# EAGLE design i2c-pressure-driver (EAGLE 9.6.2)
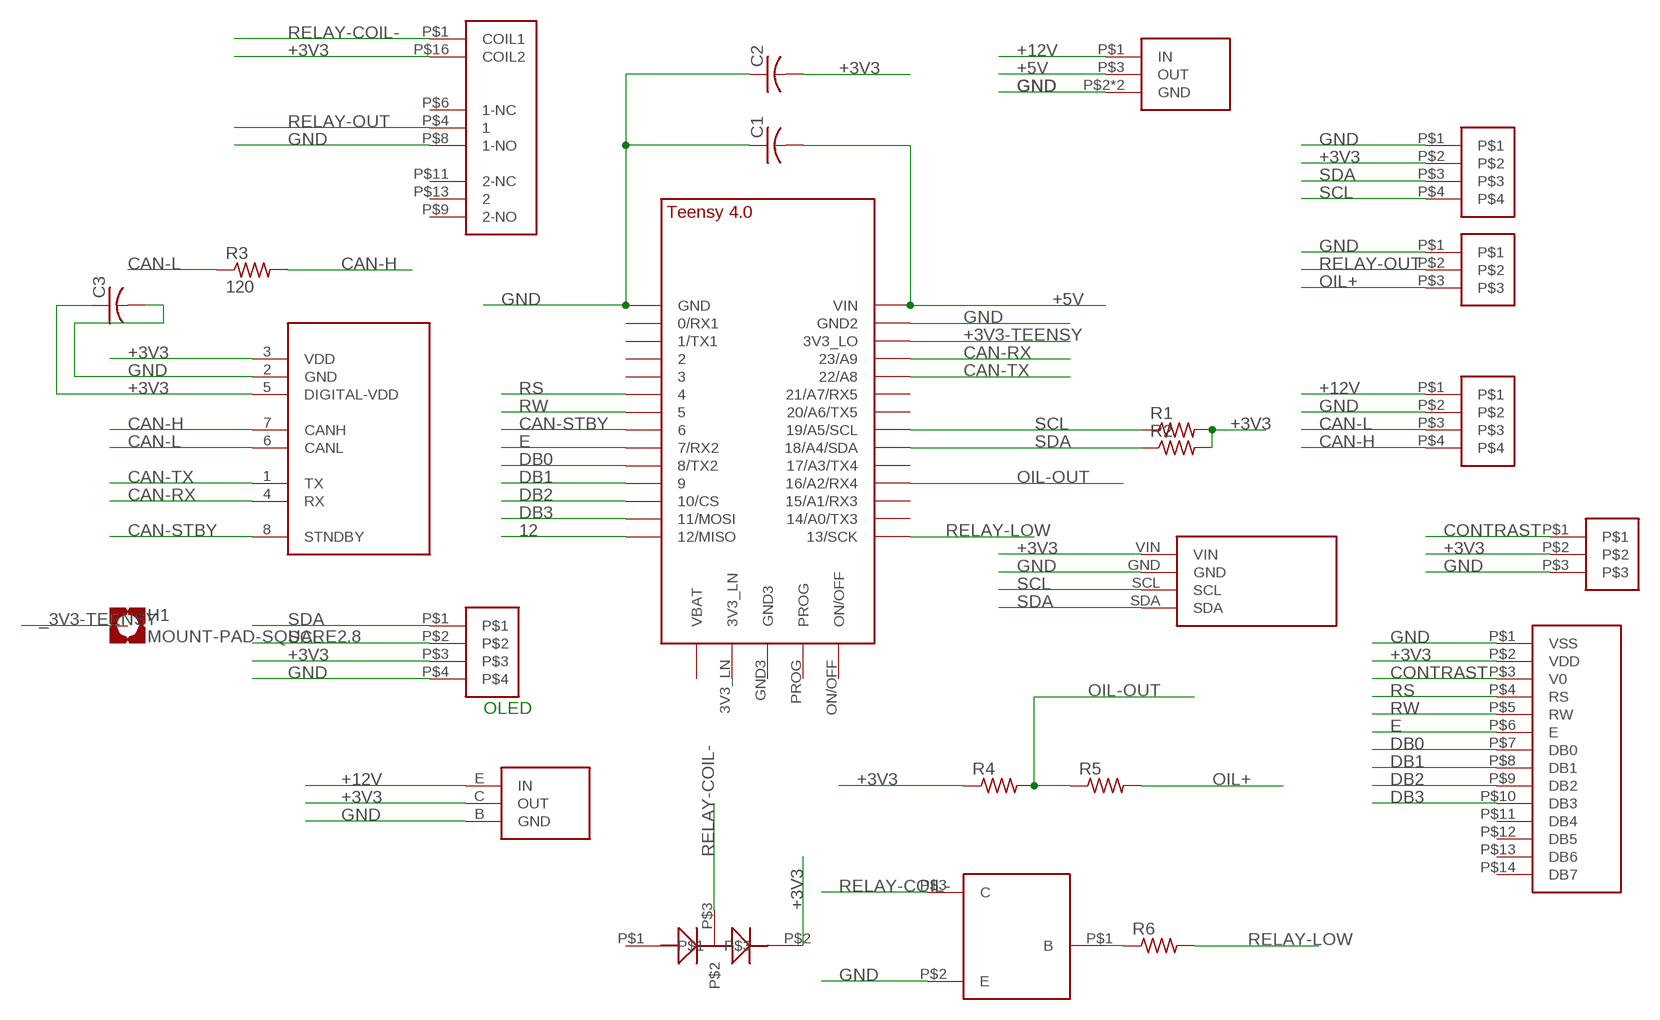
[diagram p0: schematic, sheet 1]

## Parts
C1  C-USC1210K  [C1210K]
C2  C-USC1210K  [C1210K]
C3  C-USC0603K  [C0603K]
H1  MOUNT-PAD-SQUARE2.8  [2,8-PAD-SQUARE]
R1  R-US_R0805  [R0805]
R2  R-US_R0805  [R0805]
R3  120  R-US_R0805W  [R0805W]
R4  R-US_M0805  [M0805]
R5  R-US_M0805  [M0805]
R6  R-US_R0805  [R0805]
U$1  TEENSY_4.0  [TEENSY_4.0]
U$2  NEWHAVEN-LCD-8X2  [NEWHAVEN-8X2-LCD]
U$3  LDO-3.3V-AZ1117CR-3.3TRG1  [SOT89-BCE]
U$4  1X4-1725672  [1X4-1725672]
U$5  1X3-1725669  [1X3-1725669]
U$6  1X4-1725672  [1X4-1725672]
U$7  MCP2562FD-CAN-TRANCIEVER  [SOIC8]
U$8  TC33X-2-102E-POT  [TC33-X-2]
U$9  1X4-1725672  [1X4-1725672]
U$10  LDO-5V-AZ1117CH2-5.0TRG1  [SOT-223]
U$11  BMP180-BREKOUT  [BMP180-BOARD]
U$12  RELAY-AMAZON  [RELAY-3V-AMAZON]
U$13  NPN-GENERAL  [SOT23]
U$14  DIODE-MMBD4148SE  [SOT23]

## Nets
12: U$1.12/MISO
+3V3: C2.2 C3.1 R1.2 R2.2 R4.1 U$2.P$2(VDD) U$3.C(OUT) U$4.P$2 U$7.3(VDD) U$7.5(DIGITAL-VDD) U$8.P$2 U$9.P$3 U$11.VIN U$12.P$16(COIL2) U$14.P$2
+3V3-TEENSY: U$1.3V3_LO
+5V: C1.2 U$1.VIN U$10.P$3(OUT)
+12V: U$3.E(IN) U$6.P$1 U$10.P$1(IN)
_3V3-TEENSY: H1.B2,8(MOUNT)
CAN-H: R3.2 U$6.P$4 U$7.7(CANH)
CAN-L: R3.1 U$6.P$3 U$7.6(CANL)
CAN-RX: U$1.23/A9 U$7.4(RX)
CAN-STBY: U$1.6 U$7.8(STNDBY)
CAN-TX: U$1.22/A8 U$7.1(TX)
CONTRAST: U$2.P$3(V0) U$8.P$1
DB0: U$1.8(8/TX2) U$2.P$7(DB0)
DB1: U$1.9/CS U$2.P$8(DB1)
DB2: U$1.10/CS U$2.P$9(DB2)
DB3: U$1.11/MOSI U$2.P$10(DB3)
E: U$1.7(7/RX2) U$2.P$6(E)
GND: C1.1 C2.1 C3.2 U$1.GND U$1.GND2 U$2.P$1(VSS) U$3.B(GND) U$4.P$1 U$5.P$1 U$6.P$2 U$7.2(GND) U$8.P$3 U$9.P$4 U$10.P$2(GND) U$10.PAD(GND) U$11.GND U$12.P$8(1-NO) U$13.P$2(E)
N$3: R6.1 U$13.P$1(B)
OIL+: R5.2 U$5.P$3
OIL-OUT: R4.2 R5.1 U$1.16/A2(16/A2/RX4)
RELAY-COIL-: U$12.P$1(COIL1) U$13.P$3(C) U$14.P$3
RELAY-LOW: R6.2 U$1.13/SCK
RELAY-OUT: U$5.P$2 U$12.P$4
RS: U$1.4/CANRX U$2.P$4(RS)
RW: U$1.5 U$2.P$5(RW)
SCL: R1.1 U$1.19/A5/SCL U$4.P$4 U$9.P$2 U$11.SCL
SDA: R2.1 U$1.18/A4/SDA U$4.P$3 U$9.P$1 U$11.SDA
Unconnected: U$1.0/RX(0/RX1) U$1.1/TX(1/TX1) U$1.2 U$1.3/CANTX U$1.3V3_LN U$1.14/A0(14/A0/TX3) U$1.15/A1(15/A1/RX3) U$1.17/A3(17/A3/TX4) U$1.20/A6(20/A6/TX5) U$1.21/A7(21/A7/RX5) U$1.GND3 U$1.ON/OFF U$1.PROG U$1.VBAT\(VBAT) U$2.P$11(DB4) U$2.P$12(DB5) U$2.P$13(DB6) U$2.P$14(DB7) U$12.P$6(1-NC) U$12.P$9(2-NO) U$12.P$11(2-NC) U$12.P$13 U$14.P$1

## Notes on the sheet
- OLED

## Library data of the parts
C1-C3 = rcl:C-US: CAPACITOR, American symbol; SPICEPREFIX: C
H1 = holes:MOUNT-PAD-SQUARE: MOUNTING PAD, square
R1-R6 = rcl:R-US_: RESISTOR, American symbol; SPICEPREFIX: R
U$1 = TEENSY 4.0:TEENSY_4.0
U$2 = mgregg:NEWHAVEN-LCD-8X2
U$3 = mgregg:LDO-3.3V-AZ1117CR-3.3TRG1
U$4 U$6 U$9 = mgregg:1X4-1725672
U$5 = mgregg:1X3-1725669
U$7 = mgregg:MCP2562FD-CAN-TRANCIEVER
U$8 = mgregg:TC33X-2-102E-POT
U$10 = mgregg:LDO-5V-AZ1117CH2-5.0TRG1
U$11 = mgregg:BMP180-BREKOUT
U$12 = mgregg:RELAY-AMAZON
U$13 = mgregg:NPN-GENERAL
U$14 = mgregg:DIODE-MMBD4148SE

## Board
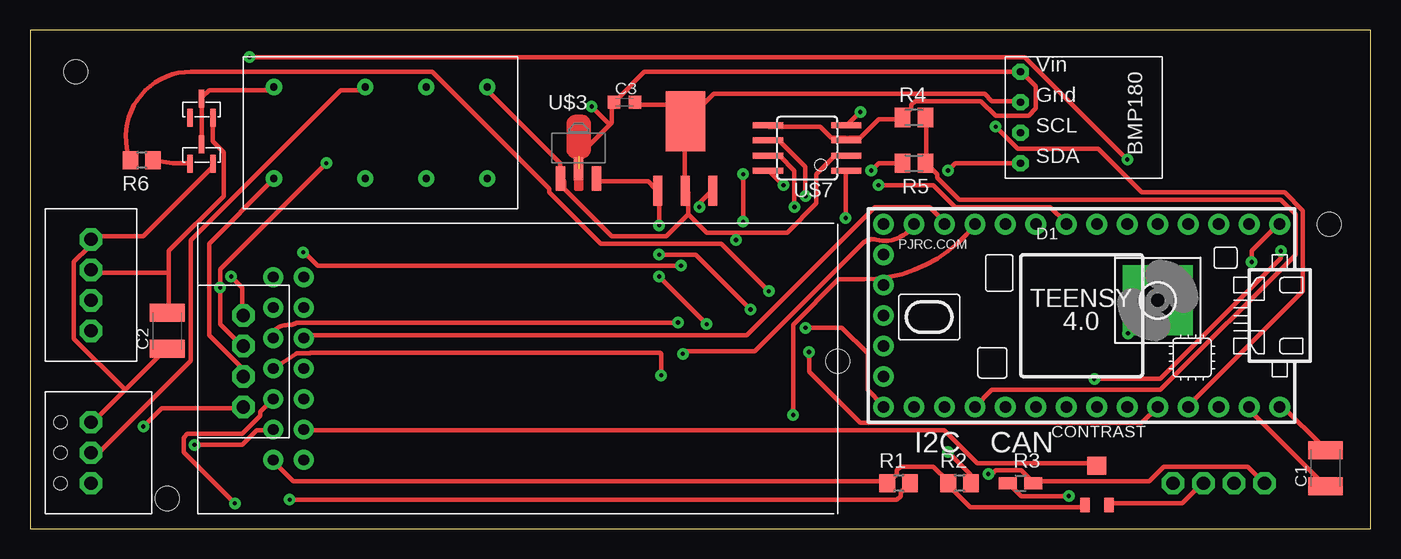
[diagram p1: board, top side]
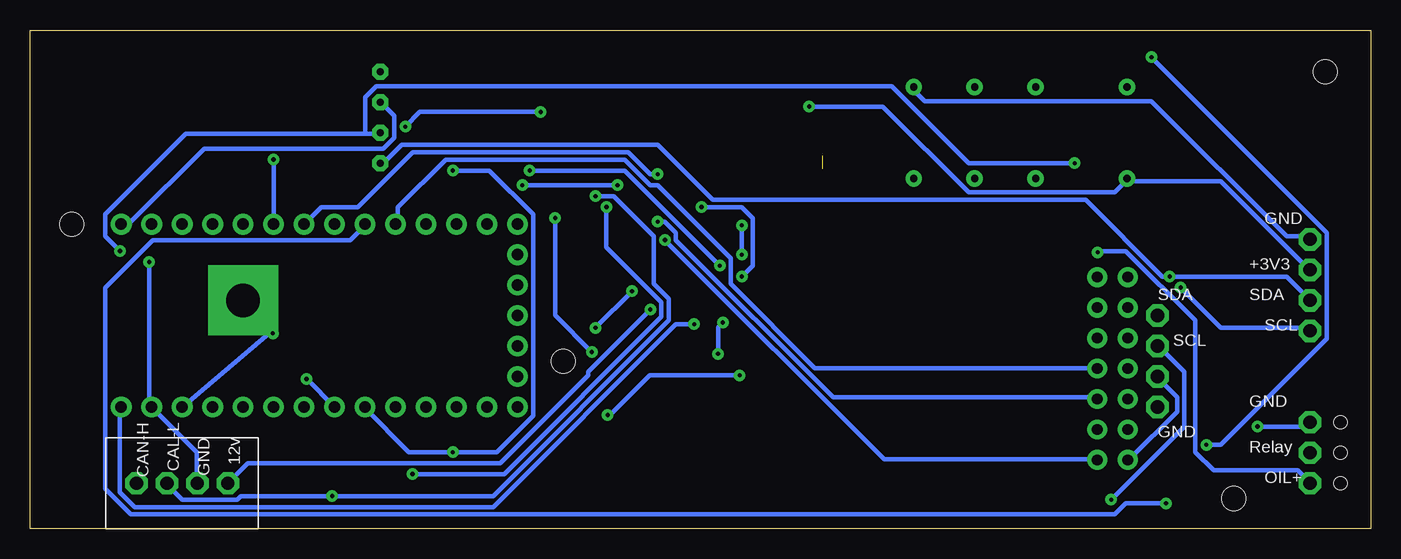
[diagram p2: board, bottom side, seen from below]

Size 111.74 x 41.58 mm. Coordinates in mm from the lower left corner, seen from the top.
Outline: 0,0 111.74,0 111.74,41.58 0,41.58 0,0
Copper layers (1*16): Top 0.035mm / dielectric 1.5mm / Bottom 0.035mm
Design rules "default *": minimum track width 14mil, minimum drill 0.35mm, track to track 10mil, track to pad 10mil, pad to pad 10mil, via to via 10mil, smd to smd 10mil, copper to edge 40mil, drill to drill 10mil, minimum pad ring 15mil, minimum via ring 12mil, stop-mask expansion 4mil, vias tented up to drill 0mil, thermal gap 10mil
Holes 2 mm at 67.31,13.97 11.43,2.54 108.27,25.4 3.81,38.1

### Footprints (pad centres in the part's own frame; a part is rotated, then mirrored left to right if it is on the bottom)
C1210K = smd 1.5 x 2.9: 1 -1.5,0; 2 1.5,0
C0603K = smd 1.05 x 1.08: 1 -0.875,0; 2 0.875,0
2,8-PAD-SQUARE = drill 2.8 pad 5.842 square: B2,8 0,0
R0805 = smd 1.3 x 1.5: 1 -0.95,0; 2 0.95,0
R0805W = smd 1.5 x 1: 1 -1.052,0; 2 1.052,0
M0805 = smd 1.3 x 1.6: 1 -0.95,0; 2 0.95,0
TEENSY_4.0 = drill 0.965: 0/RX -13.97,-7.62; 1/TX -11.43,-7.62; 2 -8.89,-7.62; 3/CANTX -6.35,-7.62; 3V3_LN 16.51,-2.54; 3V3_LO -11.43,7.62; 4/CANRX -3.81,-7.62; 5 -1.27,-7.62; 6 1.27,-7.62; 7 3.81,-7.62; 8 6.35,-7.62; 9/CS 8.89,-7.62; 10/CS 11.43,-7.62; 11/MOSI 13.97,-7.62; 12/MISO 16.51,-7.62; 13/SCK 16.51,7.62; 14/A0 13.97,7.62; 15/A1 11.43,7.62; 16/A2 8.89,7.62; 17/A3 6.35,7.62; 18/A4/SDA 3.81,7.62; 19/A5/SCL 1.27,7.62; 20/A6 -1.27,7.62; 21/A7 -3.81,7.62; 22/A8 -6.35,7.62; 23/A9 -8.89,7.62; GND -16.51,-7.62; GND2 -13.97,7.62; GND3 16.51,0; ON/OFF 16.51,5.08; PROG 16.51,2.54; VBAT\ 16.51,-5.08; VIN -16.51,7.62
NEWHAVEN-8X2-LCD = drill 0.9: P$1 8.84,4.48; P$2 6.3,4.48; P$3 8.84,7.02; P$4 6.3,7.02; P$5 8.84,9.56; P$6 6.3,9.56; P$7 8.84,12.1; P$8 6.3,12.1; P$9 8.84,14.64; P$10 6.3,14.64; P$11 8.84,17.18; P$12 6.3,17.18; P$13 8.84,19.72; P$14 6.3,19.72
SOT89-BCE = smd 0.8 x 2.032: B -1.499,-2.54; E 1.499,-2.54 | smd 0.8 x 1.9: C 0,-1.727
1X4-1725672 = drill 1.1 octagon: P$1 0,3.81; P$2 0,1.27; P$3 0,-1.27; P$4 0,-3.81
1X3-1725669 = drill 1.1 octagon: P$1 0,2.54; P$2 0,0; P$3 0,-2.54 | hole 1.1: -2.54,2.54; -2.54,0; -2.54,-2.54
SOIC8 = smd 0.5 x 2.54: 1 -1.905,-3.251; 2 -0.645,-3.251; 3 0.625,-3.251; 4 1.895,-3.251; 5 1.905,3.251; 6 0.635,3.251; 7 -0.635,3.251; 8 -1.905,3.251
TC33-X-2 = smd 1.6 x 1.5: P$1 0,1.45 | smd 0.8 x 1.2: P$2 -1,-1.8; P$3 1,-1.8
SOT-223 = smd 0.75 x 2.5: P$1 -2.3,-2.3; P$2 0,-2.3; P$3 2.3,-2.3 | smd 3.3 x 5: PAD 0,3.5
BMP180-BOARD = drill 0.6 octagon: GND 0,0; SCL 2.54,0; SDA 5.08,0; VIN -2.54,0
RELAY-3V-AMAZON = drill 0.6: P$1 0,0; P$4 7.62,0; P$6 12.7,0; P$8 17.78,0; P$9 17.78,-7.62; P$11 12.7,-7.62; P$13 7.62,-7.62; P$16 0,-7.62
SOT23 = smd 0.45 x 1.5: P$1 -1.9,-1.3; P$2 0,-1.3; P$3 -0.95,0.3

### Placement (x,y rotation side)
C1  107.95,5.08 90 top
C2  11.43,16.51 90 top
C3  49.53,35.56 0 top
H1  93.98,19.05 0 top
R1  72.39,3.81 180 top
R2  77.47,3.81 180 top
R3  82.55,3.81 0 top
R4  73.66,34.29 0 top
R5  73.66,30.48 180 top
R6  9.31,30.72 180 top
U$1  87.63,17.78 180 top
U$2  13.97,1.27 0 top
U$3  45.72,31.75 0 top
U$4  5.08,20.32 0 top
U$5  5.08,6.35 0 top
U$6  99.06,3.81 270 bottom
U$7  64.77,31.75 90 top
U$8  88.9,3.81 0 top
U$9  17.78,13.97 0 top
U$10  54.61,30.48 0 top
U$11  82.55,35.56 270 top
U$12  20.32,36.83 0 top
U$13  15.24,31.75 0 top
U$14  15.24,35.56 0 top

### Tracks (layer width: path | path; a pad name or v marks a point on that pad's centre or on a via)
+3V3  (via drill 0.35)  (1 unrouted)
  Top 0.254: 48.51,35.56 C3.1 | 71.63,3.81 R1.2 | 76.45,3.81 R2.2 76.71,3.81 | 68.07,32.26 U$7.3 | 87.88,1.78 U$8.P$2
  Top 0.356: U$7.5 61.57,33.53 65.84,33.53 66.75,32.61 67.97,32.61 U$7.3 68.28,32.61 69.19,32.61 70.71,34.14 72.54,34.14 R4.1 72.85,34.44 73.46,35.05 73.46,35.36 73.76,35.66 79.25,35.66 80.47,34.44 83.21,34.44 83.82,35.05 83.82,36.88 82.6,38.1 U$11.VIN 51.21,38.1 48.77,35.66 C3.1 48.46,35.36 48.46,33.83 48.32,33.69 | 45.72,31.09 48.32,33.69 | U$14.P$2 15.24,32.31 16.15,31.39 16.15,27.74 11.58,23.16 11.58,21.34 | 11.58,21.34 11.58,18.29 C2.2 | U$8.P$2 87.78,1.83 78.33,1.83 76.5,3.66 R2.2 76.5,3.96 75.29,5.18 72.54,5.18 72.24,4.88 72.24,4.57 71.63,3.96 R1.2 71.32,3.96 21.95,3.96 20.42,5.49 U$2.P$2 | U$9.P$3 17.68,12.8 17.68,13.41 14.94,16.15 14.94,23.77 20.12,28.96 U$12.P$16 | 11.58,21.34 5.18,21.34 U$4.P$2 | v46.81,35.2 48.32,33.69
  Bottom 0.356: U$2.P$2 20.12,5.79 16.15,9.75 16.15,10.97 17.68,12.5 U$9.P$3 | U$4.P$2 5.18,21.64 12.5,28.96 20.12,28.96 U$12.P$16 20.42,28.96 21.34,28.04 33.53,28.04 40.69,35.2 v46.81,35.2
+3V3-TEENSY  (via drill 0.35)
  Top 0.356: v91.5,16.3 91.6,17.1
  Bottom 0.356: U$1.3V3_LO 91.8,16.3 arc80 v91.5,16.3
+5V  (via drill 0.35)
  Top 0.356: v55.78,26.82 55.78,27.13 56.69,28.04 U$10.P$3 | v56.39,17.07 v52.43,21.03 | C1.2 107.9,6.71 104.24,10.36 U$1.VIN
  Bottom 0.356: v55.78,26.82 52.43,26.82 51.51,25.91 51.51,21.95 v52.43,21.03 | v56.39,17.07 57.91,17.07 73.15,1.83 103.02,1.83 104.24,3.05 104.24,10.06 U$1.VIN
+12V  (via drill 0.35)
  Top 0.254: 47.24,29.21 U$3.E
  Top 0.356: U$3.E 47.24,28.96 51.51,28.96 52.12,28.35 U$10.P$1 52.43,28.04 v52.43,25.3 | v52.43,22.86 55.47,22.86 v60.05,18.29
  Bottom 0.356: v52.43,22.86 v52.43,25.3 | v60.05,18.29 65.23,13.11 65.23,12.8 72.54,5.49 93.57,5.49 U$6.P$1
CAN-H  (via drill 0.35)
  Top 0.254: 61.72,30.99 U$7.7
  Top 0.356: U$6.P$4 101.5,5.18 94.49,5.18 93.27,3.96 83.82,3.96 R3.2 83.52,3.96 82.6,4.88 80.47,4.88 80.16,4.57 v79.86,4.57 | v63.7,26.82 63.7,29.87 62.48,31.09 61.57,31.09 U$7.7
  Bottom 0.356: v63.7,26.82 63.7,23.47 59.13,18.9 59.13,17.68 72.24,4.57 v79.86,4.57
CAN-L  (via drill 0.35)
  Top 0.254: 61.72,32.51 U$7.6
  Top 0.356: v86.56,2.74 82.6,2.74 81.69,3.66 R3.1 | v64.62,27.74 64.62,30.18 62.48,32.31 61.57,32.31 U$7.6
  Bottom 0.356: U$6.P$3 100.28,3.66 99.06,2.44 94.49,2.44 94.18,2.74 v86.56,2.74 73.15,2.74 58.52,17.37 58.52,19.2 59.74,20.42 59.74,24.38 63.09,27.74 v64.62,27.74
CAN-RX  (via drill 0.35)
  Top 0.254: 68.07,33.53 U$7.4
  Top 0.356: v69.19,34.75 68.28,33.83 U$7.4 | v80.47,33.53 82.3,31.7 89,31.7 92.66,28.04 104.55,28.04 106.07,26.52 106.07,19.81 96.62,10.36 U$1.23/A9
  Bottom 0.356: v69.19,34.75 79.25,34.75 v80.47,33.53
CAN-STBY  (via drill 0.35)
  Top 0.254: 61.72,29.72 U$7.8
  Top 0.356: v62.79,28.65 61.57,29.87 U$7.8 | v70.71,28.65 75.29,28.65 77.11,26.82 85.04,26.82 86.26,25.6 U$1.6
  Bottom 0.356: v70.71,28.65 v62.79,28.65
CAN-TX  (via drill 0.35)
  Top 0.254: 68.07,29.97 U$7.1
  Top 0.356: v67.97,25.91 67.97,29.87 U$7.1 | v64.92,14.74 64.92,13.11 69.19,8.84 92.66,8.84 U$1.22/A8
  Bottom 0.356: v67.97,25.91 67.97,17.79 v64.92,14.74
CONTRAST
  Top 0.254: 88.9,5.08 U$8.P$1
  Top 0.356: U$8.P$1 88.7,5.49 78.94,5.49 76.2,8.23 22.86,8.23 U$2.P$3
DB0
  Bottom 0.356: U$2.P$7 22.86,13.41 46.33,13.41 53.34,20.42 53.34,22.55 59.44,28.65 60.05,28.65 62.18,30.79 77.11,30.79 81.08,26.82 81.08,25.6 U$1.8
DB1  (via drill 0.35)
  Top 0.356: U$2.P$8 22.2,14.6 22.25,14.65 23.33,14.65 23.39,14.7 52.5,14.7 52.6,14.6 v52.6,12.8 | U$1.9/CS arc-53 69.5,20.8 67.36,20.8 63.6,17.04 v63.6,9.5
  Bottom 0.356: v52.6,12.8 60.1,12.8 63.5,9.4 v63.6,9.5
DB2
  Top 0.356: U$2.P$9 22.86,16.15 59.74,16.15 70.41,26.82 74.98,26.82 76.2,25.6 U$1.10/CS
DB3  (via drill 0.35)
  Top 0.356: U$2.P$10 20.27,16.46 20.32,16.51 arc-48 21.6,17 arc43 22.2,17.2 22.27,17.2 22.29,17.19 23.33,17.19 23.35,17.2 v54,17.2 | v54.4,14.6 54.6,14.8 60.4,14.8 69.4,23.8 arc-59 70.5,24.1 arc74 U$1.11/MOSI
  Bottom 0.356: v54,17.2 54.4,16.8 v54.4,14.6
E  (via drill 0.35)
  Top 0.356: v17.07,2.13 12.8,6.4 12.8,7.62 13.11,7.92 17.68,7.92 19.2,9.45 19.2,9.75 20.12,10.67 U$2.P$6
  Bottom 0.356: v17.07,2.13 20.42,2.13 21.34,1.22 103.33,1.22 105.46,3.35 105.46,20.12 101.5,24.08 85.04,24.08 83.82,25.3 U$1.7
GND  (via drill 0.35)
  Top 0.254: 89.92,1.78 U$8.P$3 | 44.2,29.21 U$3.B | 107.95,3.81 C1.1 | 50.29,35.56 C3.2 | 11.43,14.99 C2.1
  Top 0.356: U$13.P$2 15.24,30.18 9.45,24.38 5.18,24.38 U$4.P$1 4.88,24.08 4.88,23.47 3.66,22.25 3.66,15.85 7.92,11.58 | 7.92,11.58 5.18,8.84 U$5.P$1 | 7.92,11.58 11.28,14.94 C2.1 | v9.45,8.53 10.97,10.06 17.68,10.06 U$9.P$4 | U$8.P$3 89.92,2.13 96.01,2.13 97.54,3.66 U$6.P$2 | C1.1 107.9,3.66 101.5,10.06 U$1.GND2 | U$12.P$8 38.1,36.58 44.2,30.48 44.2,29.26 U$3.B 44.5,28.96 44.5,28.35 48.46,24.38 53.03,24.38 54.86,26.21 | C3.2 50.6,35.36 53.34,35.36 54.56,34.14 U$10.PAD | U$10.PAD 54.56,33.83 54.56,28.35 U$10.P$2 54.86,28.04 54.86,26.21 | 58.83,24.69 56.39,24.69 54.86,26.21 | 58.83,24.69 63.09,24.69 65.53,27.13 65.53,29.57 67.06,31.09 67.97,31.09 U$7.2 | U$11.GND 82.3,35.66 80.16,35.66 79.55,36.27 57,36.27 54.86,34.14 U$10.PAD | 58.83,24.69 v58.83,24.08 | v101.8,22.25 101.8,23.16 103.94,25.3 U$1.GND
  Bottom 0.356: v9.45,8.53 5.49,8.53 5.18,8.84 U$5.P$1 | U$6.P$2 97.84,3.96 97.84,6.4 U$1.GND2 101.8,10.36 v101.8,22.25 | v58.83,24.08 40.54,5.79 22.86,5.79 U$2.P$1 | U$1.GND 103.94,25.6 103.33,25.6 97.23,31.7 82.3,31.7 81.38,32.61 81.38,34.44 82.3,35.36 U$11.GND | U$4.P$1 5.18,24.38 7.01,24.38 18.29,35.66 37.19,35.66 38.1,36.58 U$12.P$8
N$3
  Top 0.356: U$13.P$1 13.41,30.48 11.89,30.48 R6.1
OIL+  (via drill 0.35)
  Top 0.356: R5.2 70.71,30.48 v70.1,29.87 | v54.25,21.95 23.97,21.95 22.86,23.05 v22.77,23.05
  Bottom 0.356: v70.1,29.87 62.18,29.87 v54.25,21.95 | v22.77,23.05 22.57,23.05 22.46,23.16 20.41,23.16 14.63,17.37 14.63,6.4 13.11,4.88 6.1,4.88 5.18,3.96 U$5.P$3
OIL-OUT
  Top 0.356: 74.68,30.48 74.68,34.14 R4.2 | 74.68,30.48 75.59,29.57 75.59,29.26 77.42,27.43 104.24,27.43 105.46,26.21 105.46,22.86 94.18,11.58 80.16,11.58 U$1.16/A2 | 74.68,30.48 R5.1
RELAY-COIL-
  Top 0.356: U$13.P$3 14.33,32.31 14.33,35.66 U$14.P$3 14.33,35.97 14.94,36.58 20.12,36.58 U$12.P$1
RELAY-LOW  (via drill 0.35)
  Top 0.356: v61.57,19.81 57.61,23.77 47.55,23.77 43.28,28.04 43.28,28.35 33.53,38.1 13.41,38.1 arc111 R6.2 | v64.62,16.76 67.67,16.76 69.8,14.63 69.8,11.58 71.02,10.36 U$1.13/SCK
  Bottom 0.356: v64.62,16.76 v61.57,19.81
RELAY-OUT
  Top 0.356: U$12.P$4 27.74,36.58 25.91,36.58 13.41,24.08 13.41,14.02 5.79,6.4 5.18,6.4 U$5.P$2
RS  (via drill 0.35)
  Top 0.356: v13.72,7.01 17.68,7.01 18.9,8.23 20.12,8.23 U$2.P$4 | v18.29,39.32 82.91,39.32 v91.44,30.79
  Bottom 0.356: v13.72,7.01 12.5,7.01 3.66,15.85 3.66,24.69 v18.29,39.32 | U$1.4/CANRX v91.44,30.79
RW  (via drill 0.35)
  Top 0.356: v59.44,29.57 v59.44,25.6
  Bottom 0.356: v59.44,25.6 58.83,25.6 57.91,24.69 57.91,24.08 44.81,10.97 22.86,10.97 U$2.P$5 | v59.44,29.57 60.05,29.57 61.87,31.39 79.86,31.39 84.43,26.82 87.48,26.82 U$1.5
SCL  (via drill 0.35)
  Top 0.356: v104.24,23.16 104.24,22.55 94.18,12.5 v88.7,12.5 | v21.64,2.44 72.24,2.44 72.54,2.74 72.54,3.05 73.15,3.66 R1.1 | U$9.P$2 17.68,15.24 15.85,17.07 v15.85,20.12 15.85,21.64 v24.69,30.48
  Bottom 0.356: 83.82,32.92 98.75,32.92 105.46,26.21 105.46,24.38 v104.24,23.16 | 83.82,32.92 82.6,32.92 U$11.SCL | U$1.19/A5/SCL v88.7,12.5 | v21.64,2.44 15.54,8.53 15.54,13.11 17.68,15.24 U$9.P$2 | v15.85,20.12 12.5,16.76 5.18,16.76 U$4.P$4 | 83.82,32.92 83.82,35.97 82.91,36.88 39.93,36.88 33.53,30.48 v24.69,30.48
SDA  (via drill 0.35)
  Top 0.356: v16.76,21.03 17.68,20.12 17.68,17.98 U$9.P$1 | v76.5,6.4 78.33,4.57 78.33,3.96 R2.1 | U$11.SDA 77.11,30.48 v76.5,29.87
  Bottom 0.356: U$4.P$3 5.18,19.2 7.01,21.03 v16.76,21.03 17.37,21.03 23.77,27.43 54.86,27.43 59.44,32 80.77,32 82.3,30.48 U$11.SDA | U$1.18/A4/SDA 83.82,10.06 80.16,6.4 v76.5,6.4 72.85,6.4 69.8,9.45 69.8,26.21 73.46,29.87 v76.5,29.87

### Text on the board
tPlace: D1 | CONTRAST | I2C | CAN
bPlace: GND | +3V3 | SDA | SDA | SCL | SCL | GND | CAL-L | CAN-H | GND | 12v | GND | Relay | OIL+